# EAGLE design PIC18-USB+ICSP-Board (EAGLE 7.2.0)
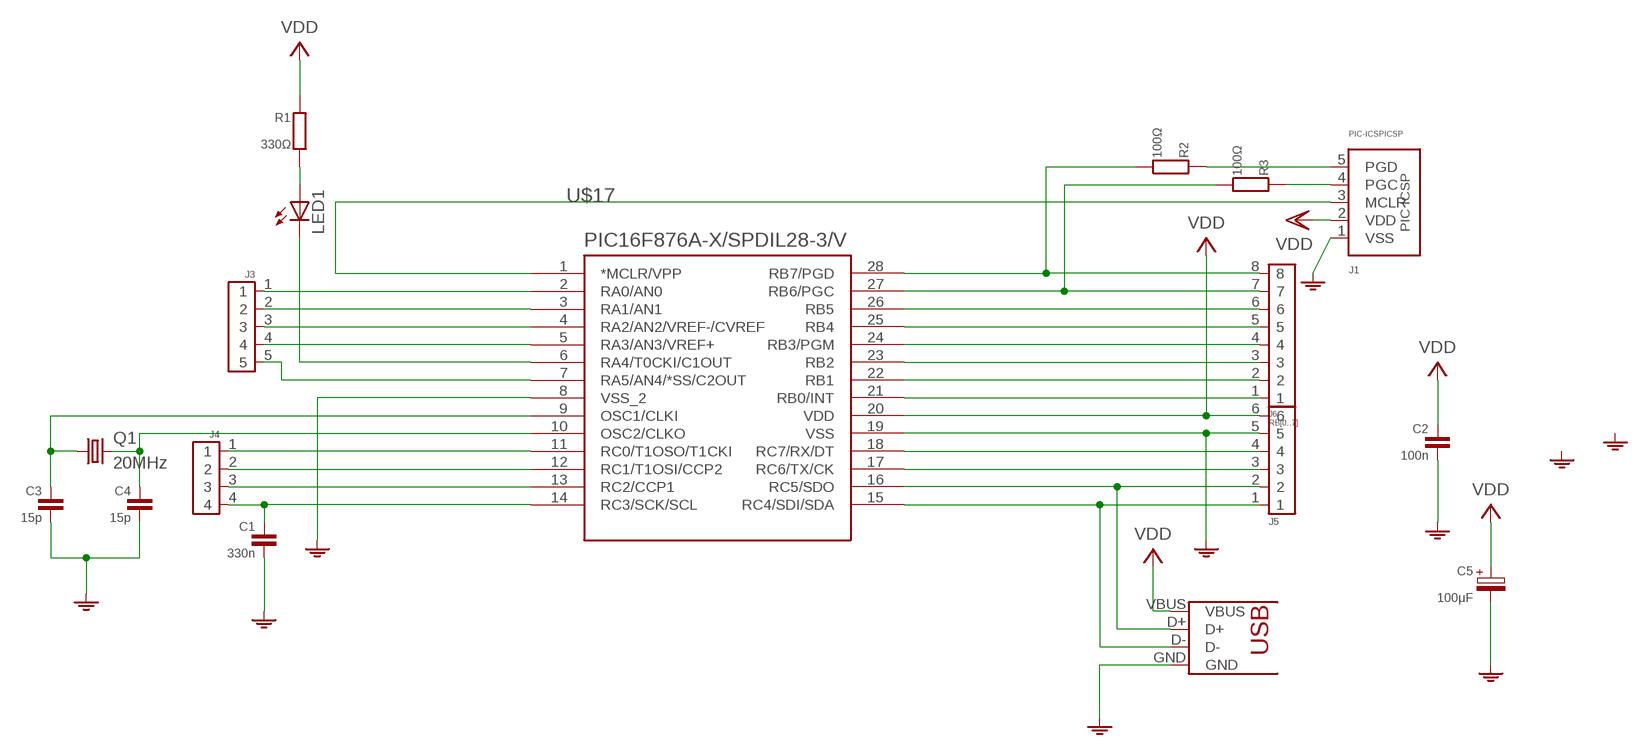
[diagram p0: schematic, sheet 1]

## Parts
C1  330n  C050-030X075  [C050-030X075]
C2  100n  C025-015X024  [C025-015X024]
C3  15p  C025-015X024  [C025-015X024]
C4  15p  C025-015X024  [C025-015X024]
C5  100μF  CPOLE2.5-5  [E2,5-5]
J1  PIC-ICSPICSP  [PIC-ICSP]
J2  USB-PRINT  [USB-B-PRINT]
J3  RA[0..4]  CONN-5P-5P  [CONN-5P]
J4  RC[0..3]  CONN-4P-4P  [CONN-4P]
J5  PWR+SCI+USB  CONN-6P  [CONN-6P]
J6  RB[0..7]  CONN-8P  [CONN-8P]
LED1  LED5MM  [LED5MM]
Q1  20MHz  CRYSTALHC49  [HC49]
R1  330Ω  R0204/10  [0204/10]
R2  100Ω  R0204/7-V  [0204/7-V]
R3  100Ω  R0204/7-V  [0204/7-V]
U$17  PIC16F876A-X/SPDIL28-3/V  [DIL28-3/V]

## Nets
/MCLR: J1.3(MCLR) U$17.1(*MCLR/VPP)
GND: C1.2 C2.2 C3.2 C4.2 C5.- J1.1(VSS) J2.GND J5.5 U$17.8(VSS_2) U$17.19(VSS)
N$1: C1.1 J4.4 U$17.14(RC3/SCK/SCL)
N$2: J2.D+ J5.2 U$17.16(RC5/SDO)
N$3: J2.D- J5.1 U$17.15(RC4/SDI/SDA)
N$4: LED1.A R1.2
N$5: J3.5 U$17.7(RA5/AN4/*SS/C2OUT)
N$6: C3.1 Q1.1 U$17.9(OSC1/CLKI)
N$7: C4.1 Q1.2 U$17.10(OSC2/CLKO)
N$8: J6.6 U$17.26(RB5)
N$9: J6.5 U$17.25(RB4)
N$10: J6.4 U$17.24(RB3/PGM)
N$11: J6.3 U$17.23(RB2)
N$12: J6.2 U$17.22(RB1)
N$13: J6.1 U$17.21(RB0/INT)
N$14: J3.1 U$17.2(RA0/AN0)
N$15: J5.4 U$17.18(RC7/RX/DT)
N$16: J5.3 U$17.17(RC6/TX/CK)
N$17: J3.2 U$17.3(RA1/AN1)
N$18: J3.3 U$17.4(RA2/AN2/VREF-/CVREF)
N$19: J3.4 U$17.5(RA3/AN3/VREF+)
N$20: LED1.K(C) U$17.6(RA4/T0CKI/C1OUT)
N$21: J4.1 U$17.11(RC0/T1OSO/T1CKI)
N$22: J4.2 U$17.12(RC1/T1OSI/CCP2)
N$23: J4.3 U$17.13(RC2/CCP1)
N$24: J1.5(PGD) R2.1
N$25: J1.4(PGC) R3.1
PGC: J6.7 R3.2 U$17.27(RB6/PGC)
PGD: J6.8 R2.2 U$17.28(RB7/PGD)
VDD: C2.1 C5.+ J1.2(VDD) J2.VBUS J5.6 R1.1 U$17.20(VDD)

## Library data of the parts
C1-C4 = c:C: CAPACITOR, European symbol
C5 = c:CPOL: POLARIZED CAPACITOR, European symbol
J1 = pinconn:PIC-ICSP
J2 = usb:USB: USB Connectors USB-B-PTH is fully proven SKU : PRT-00139 USB-miniB is fully proven SKU : PRT-00587 USB-A-PCB is untested. USB-A-H is throughly reviewed, but untested. Spark Fun Electronics SKU : PRT-00437 USB-B-SMT is throughly reviewed, but untested. Needs silkscreen touching up. USB-A-S has not been used/tested USB-MB-H has not been used/tested
J3 = pinconn:CONN-5P
J4 = pinconn:CONN-4P
J5 = pinconn:CONN-6P
J6 = pinconn:CONN-8P
LED1 = led:LED: LED OSRAM: - CHIPLED LG R971, LG N971, LY N971, LG Q971, LY Q971, LO R971, LY R971 LH N974, LH R974 LS Q976, LO Q976, LY Q976 LO Q996 - Hyper CHIPLED LW Q18S LB Q993, LB Q99A, LB R99A - SideLED LS A670, LO A670, LY A670, LG A670, LP A670 LB A673, LV A673, LT A673, LW A673 LH A674 LY A675 LS A676, LA A676, LO A676, LY A676, LW A676 LS A679, LY A679, LG A679 - Hyper Micro SIDELED® LS Y876, LA Y876, LO Y876, LY Y876 LT Y87S - SmartLED LW L88C, LW L88S LB L89C, LB L89S, LG L890 LS L89K, LO L89K, LY L89K LS L896, LA L896, LO L896, LY L896 - TOPLED LS T670, LO T670, LY T670, LG T670, LP T670 LSG T670, LSP T670, LSY T670, LOP T670, LYG T670 LG T671, LOG T671, LSG T671 LB T673, LV T673, LT T673, LW T673 LH T674 LS T676, LA T676, LO T676, LY T676, LB T676, LH T676, LSB T676, LW T676 LB T67C, LV T67C, LT T67C, LS T67K, LO T67K, LY T67K, LW E67C LS E67B, LA E67B, LO E67B, LY E67B, LB E67C, LV E67C, LT E67C LW T67C LS T679, LY T679, LG T679 LS T770, LO T770, LY T770, LG T770, LP T770 LB T773, LV T773, LT T773, LW T773 LH T774 LS E675, LA E675, LY E675, LS T675 LS T776, LA T776, LO T776, LY T776, LB T776 LHGB T686 LT T68C, LB T68C - Hyper Mini TOPLED® LB M676 - Mini TOPLED Santana® LG M470 LS M47K, LO M47K, LY M47K Source: http://www.osram.convergy.de LUXEON: - LUMILED® LXK2-PW12-R00, LXK2-PW12-S00, LXK2-PW14-U00, LXK2-PW14-V00 LXK2-PM12-R00, LXK2-PM12-S00, LXK2-PM14-U00 LXK2-PE12-Q00, LXK2-PE12-R00, LXK2-PE12-S00, LXK2-PE14-T00, LXK2-PE14-U00 LXK2-PB12-K00, LXK2-PB12-L00, LXK2-PB12-M00, LXK2-PB14-N00, LXK2-PB14-P00, LXK2-PB14-Q00 LXK2-PR12-L00, LXK2-PR12-M00, LXK2-PR14-Q00, LXK2-PR14-R00 LXK2-PD12-Q00, LXK2-PD12-R00, LXK2-PD12-S00 LXK2-PH12-R00, LXK2-PH12-S00 LXK2-PL12-P00, LXK2-PL12-Q00, LXK2-PL12-R00 Source: www.luxeon.com KINGBRIGHT: KA-3528ASYC Source: www.kingbright.com
Q1 = q:CRYSTAL
R1-R3 = r:R: RESISTOR, European symbol
U$17 = mcu:PIC16F876A-X/SP

## Board
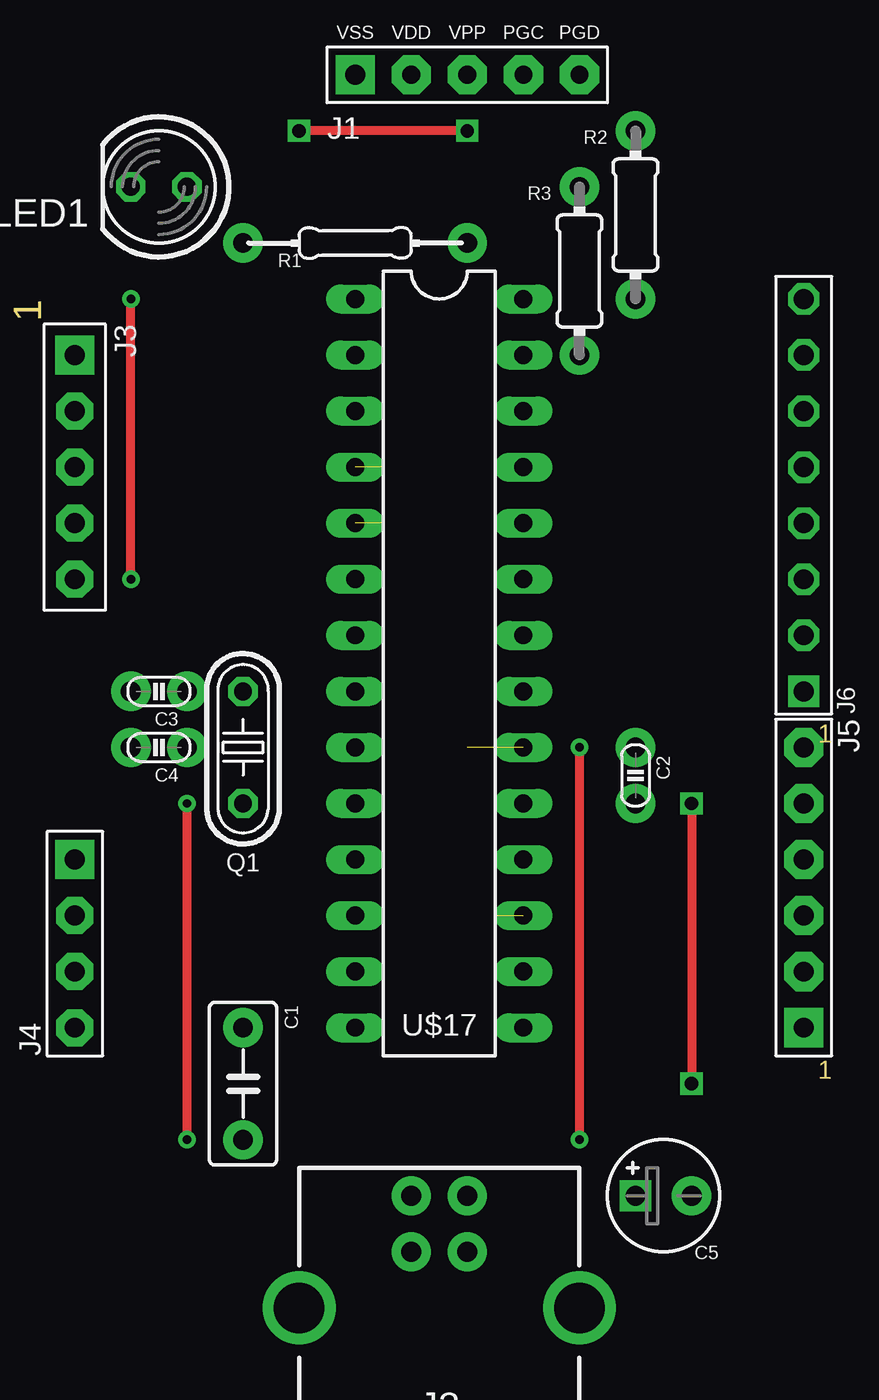
[diagram p1: board, top side]
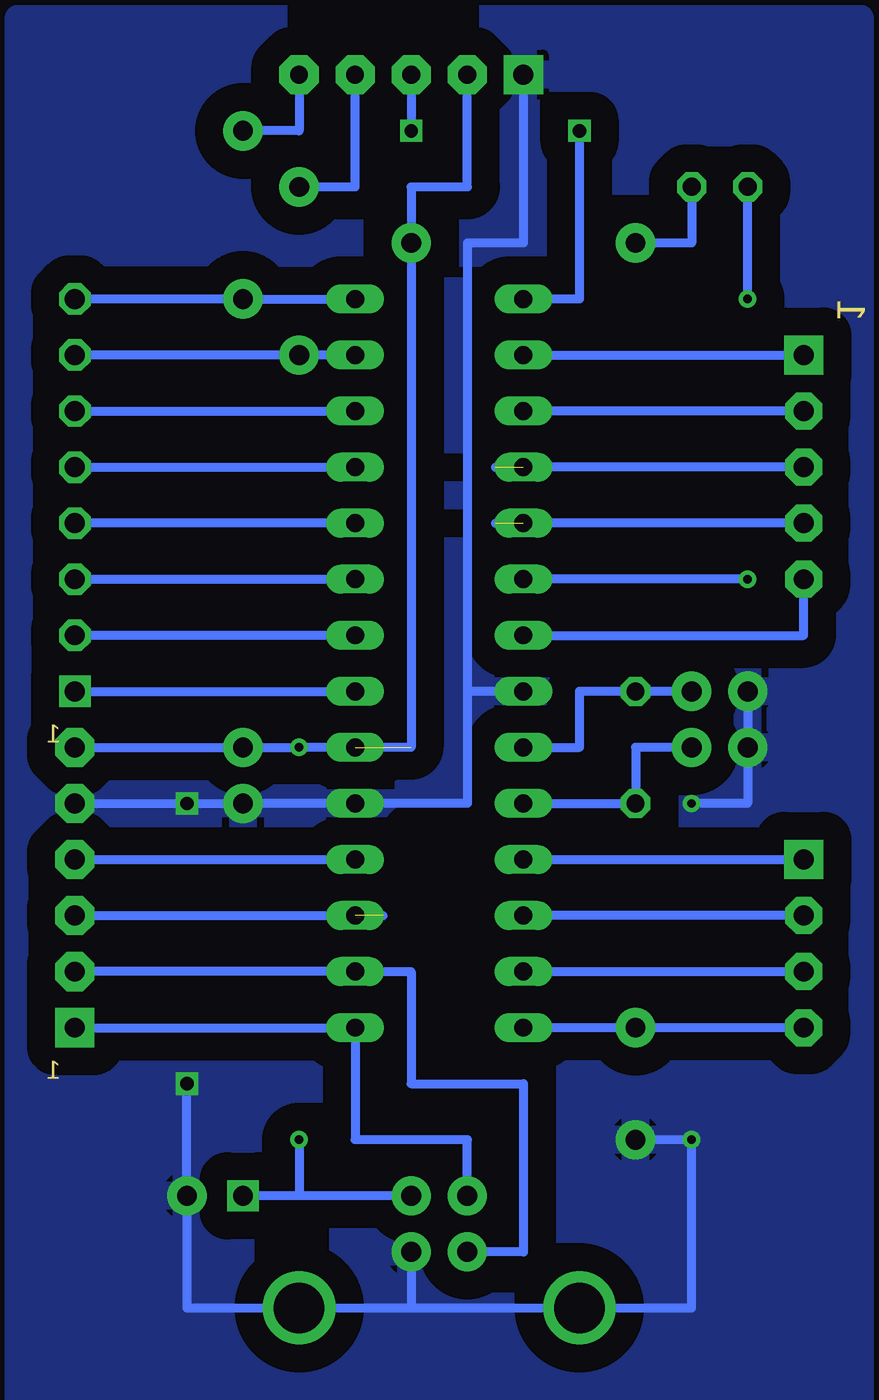
[diagram p2: board, bottom side, seen from below]

No outline drawn. Coordinates in mm, seen from the top.
Copper layers (1*16): Top 0.035mm / dielectric 1.5mm / Bottom 0.035mm
Design rules "default": minimum track width 10mil, minimum drill 24mil, track to track 8mil, track to pad 8mil, pad to pad 8mil, via to via 8mil, smd to smd 8mil, copper to edge 40mil, drill to drill 8mil, minimum pad ring 10mil, minimum via ring 8mil, stop-mask expansion 4mil, vias tented up to drill 0mil, thermal gap 10mil
bRestrict: area 17.8,24.1 to 20.3,29.2

### Footprints (pad centres in the part's own frame; a part is rotated, then mirrored left to right if it is on the bottom)
C050-030X075 = drill 0.9 pad 1.778: 1 -2.54,0; 2 2.54,0
C025-015X024 = drill 0.9 pad 1.778: 1 -1.27,0; 2 1.27,0
E2,5-5 = drill 0.9 square: + 1.27,0 | drill 0.9 pad 1.778: - -1.27,0
PIC-ICSP = drill 0.9 pad 1.778 square: 1 0,0 | drill 0.8 pad 1.778 octagon: 2 2.54,0; 3 5.08,0; 4 7.62,0; 5 10.16,0
USB-B-PRINT = drill 0.914 pad 1.778: D+ 2.54,0; D- 5.08,0; GND 2.54,-2.54; VBUS 5.08,-2.54 | drill 2.286: P$1 0,-7.62; P$2 0,5.08
CONN-5P = drill 0.9 pad 1.778 square: 1 0,0 | drill 0.9 pad 1.676 octagon: 2 2.54,0; 3 5.08,0; 4 7.62,0; 5 10.16,0
CONN-4P = drill 0.9 pad 1.778 square: 1 0,0 | drill 0.9 pad 1.676 octagon: 2 2.54,0; 3 5.08,0; 4 7.62,0
CONN-6P = drill 0.9 pad 1.778 square: 1 0,0 | drill 0.9 pad 1.778 octagon: 2 2.54,0; 3 5.08,0; 4 7.62,0; 5 10.16,0; 6 12.7,0
CONN-8P = drill 0.9 pad 1.422 square: 1 -8.89,0 | drill 0.9 pad 1.422 octagon: 2 -6.35,0; 3 -3.81,0; 4 -1.27,0; 5 1.27,0; 6 3.81,0; 7 6.35,0; 8 8.89,0
LED5MM = drill 0.813 octagon: A -1.27,0; K 1.27,0
HC49 = drill 0.813 octagon: 1 0,-2.54; 2 0,2.54
0204/10 = drill 0.9 pad 1.778: 1 -5.08,0; 2 5.08,0
0204/7-V = drill 0.9 pad 1.778: 1 0,3.81; 2 0,-3.81
DIL28-3/V = drill 0.813 long: 1 -3.81,16.51; 2 -3.81,13.97; 3 -3.81,11.43; 4 -3.81,8.89; 5 -3.81,6.35; 6 -3.81,3.81; 7 -3.81,1.27; 8 -3.81,-1.27; 9 -3.81,-3.81; 10 -3.81,-6.35; 11 -3.81,-8.89; 12 -3.81,-11.43; 13 -3.81,-13.97; 14 -3.81,-16.51; 15 3.81,-16.51; 16 3.81,-13.97; 17 3.81,-11.43; 18 3.81,-8.89; 19 3.81,-6.35; 20 3.81,-3.81; 21 3.81,-1.27; 22 3.81,1.27; 23 3.81,3.81; 24 3.81,6.35; 25 3.81,8.89; 26 3.81,11.43; 27 3.81,13.97; 28 3.81,16.51

### Placement (x,y rotation side)
C1  10.16,17.78 270 top
C2  27.94,31.75 270 top
C3  6.35,35.56 180 top
C4  6.35,33.02 180 top
C5  29.21,12.7 180 top
J1  15.24,63.5 0 top
J2  17.78,7.62 90 top
J3  2.54,50.8 270 top
J4  2.54,27.94 270 top
J5  35.56,20.32 90 top
J6  35.56,44.45 90 top
LED1  6.35,58.42 180 top
Q1  10.16,33.02 180 top
R1  15.24,55.88 180 top
R2  27.94,57.15 0 top
R3  25.4,54.61 0 top
U$17  19.05,36.83 0 top

### Tracks (layer width: path | path; a pad name or v marks a point on that pad's centre or on a via)
/MCLR  (via drill 0.6)
  Top 0.406: v20.32,60.96 v12.7,60.96
  Bottom 0.406: J1.3 v20.32,60.96 | v12.7,60.96 12.7,53.34 U$17.1
GND  (via drill 0.38, 0.6)
  Top 0.406: v30.48,30.48 v30.48,17.78 | v7.62,30.48 v7.62,15.24
  Bottom 0.406: J5.5 v30.48,30.48 C2.2 U$17.19 17.78,30.48 17.78,35.56 | C4.2 C3.2 5.08,30.48 v7.62,30.48 | 20.32,7.62 30.48,7.62 C5.- v30.48,17.78 | 20.32,7.62 7.62,7.62 v7.62,15.24 C1.2 | J1.1 15.24,55.88 17.78,55.88 17.78,35.56 | J2.GND 20.32,7.62 | U$17.8 17.78,35.56
  pour Bottom (isolate 1.27): 0,0 38.1,0 38.1,66.04 0,66.04
N$1
  Bottom 0.406: C1.1 J4.4 U$17.14
N$2
  Bottom 0.406: J2.D+ 15.24,10.16 15.24,17.78 20.32,17.78 20.32,22.86 U$17.16 J5.2
N$3
  Bottom 0.406: J2.D- 17.78,15.24 22.86,15.24 U$17.15 J5.1
N$4
  Bottom 0.406: LED1.A 7.62,55.88 R1.2
N$5
  Bottom 0.406: J3.5 2.54,38.1 U$17.7
N$6
  Bottom 0.406: C3.1 Q1.1 12.7,35.56 12.7,33.02 U$17.9
N$7
  Bottom 0.406: C4.1 10.16,33.02 Q1.2 U$17.10
N$8
  Bottom 0.406: J6.6 U$17.26
N$9
  Bottom 0.406: J6.5 U$17.25
N$10
  Bottom 0.406: U$17.24 J6.4
N$11
  Bottom 0.406: J6.3 U$17.23
N$12
  Bottom 0.406: U$17.22 J6.2
N$13
  Bottom 0.406: J6.1 U$17.21
N$14
  Bottom 0.406: U$17.2 J3.1
N$15
  Bottom 0.406: J5.4 U$17.18
N$16  (1 unrouted)
  Bottom 0.406: J5.3 21.59,25.4
N$17
  Bottom 0.406: J3.2 U$17.3
N$18  (1 unrouted)
  Bottom 0.406: J3.3 16.51,45.72
N$19  (1 unrouted)
  Bottom 0.406: J3.4 16.51,43.18
N$20  (via drill 0.38)
  Top 0.406: v5.08,40.64 v5.08,53.34
  Bottom 0.406: v5.08,53.34 LED1.K | v5.08,40.64 U$17.6
N$21
  Bottom 0.406: U$17.11 J4.1
N$22
  Bottom 0.406: J4.2 U$17.12
N$23
  Bottom 0.406: U$17.13 J4.3
N$24
  Bottom 0.406: J1.5 25.4,60.96 R2.1
N$25
  Bottom 0.406: R3.1 22.86,58.42 J1.4
PGC
  Bottom 0.406: J6.7 R3.2 U$17.27
PGD
  Bottom 0.406: J6.8 R2.2 U$17.28
VDD  (via drill 0.38)  (1 unrouted)
  Top 0.406: v25.4,33.02 v25.4,15.24
  Bottom 0.406: J1.2 17.78,58.42 20.32,58.42 R1.1 20.32,33.02 v25.4,33.02 C2.1 J5.6 | v25.4,15.24 25.4,12.7 C5.+ J2.VBUS